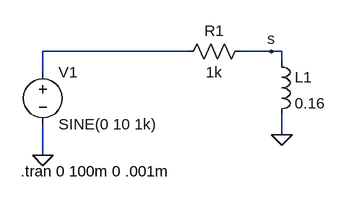
[diagram p0: schematic Draft4.asc]
Draft4.asc, the LTspice schematic file:
Version 4
SHEET 1 880 680
WIRE 64 112 -160 112
WIRE 192 112 144 112
WIRE 208 112 192 112
WIRE 208 128 208 112
WIRE -160 144 -160 112
WIRE 208 240 208 208
WIRE -160 272 -160 224
FLAG 208 240 0
FLAG -160 272 0
FLAG 192 112 s
SYMBOL ind 192 112 R0
SYMATTR InstName L1
SYMATTR Value 0.16
SYMBOL res 160 96 R90
WINDOW 0 0 56 VBottom 2
WINDOW 3 32 56 VTop 2
SYMATTR InstName R1
SYMATTR Value 1k
SYMBOL voltage -160 128 R0
WINDOW 123 0 0 Left 0
WINDOW 39 0 0 Left 0
SYMATTR InstName V1
SYMATTR Value SINE(0 10 1k)
TEXT -194 296 Left 2 !.tran 0 100m 0 .001m

The netlist it stands for:
* Draft4.asc
L1 s 0 0.16
R1 s N001 1k
V1 N001 0 SINE(0 10 1k)
.tran 0 100m 0 .001m
.backanno
.end